# EAGLE design display (EAGLE 9.5.2)

## Sheet 1 of 2
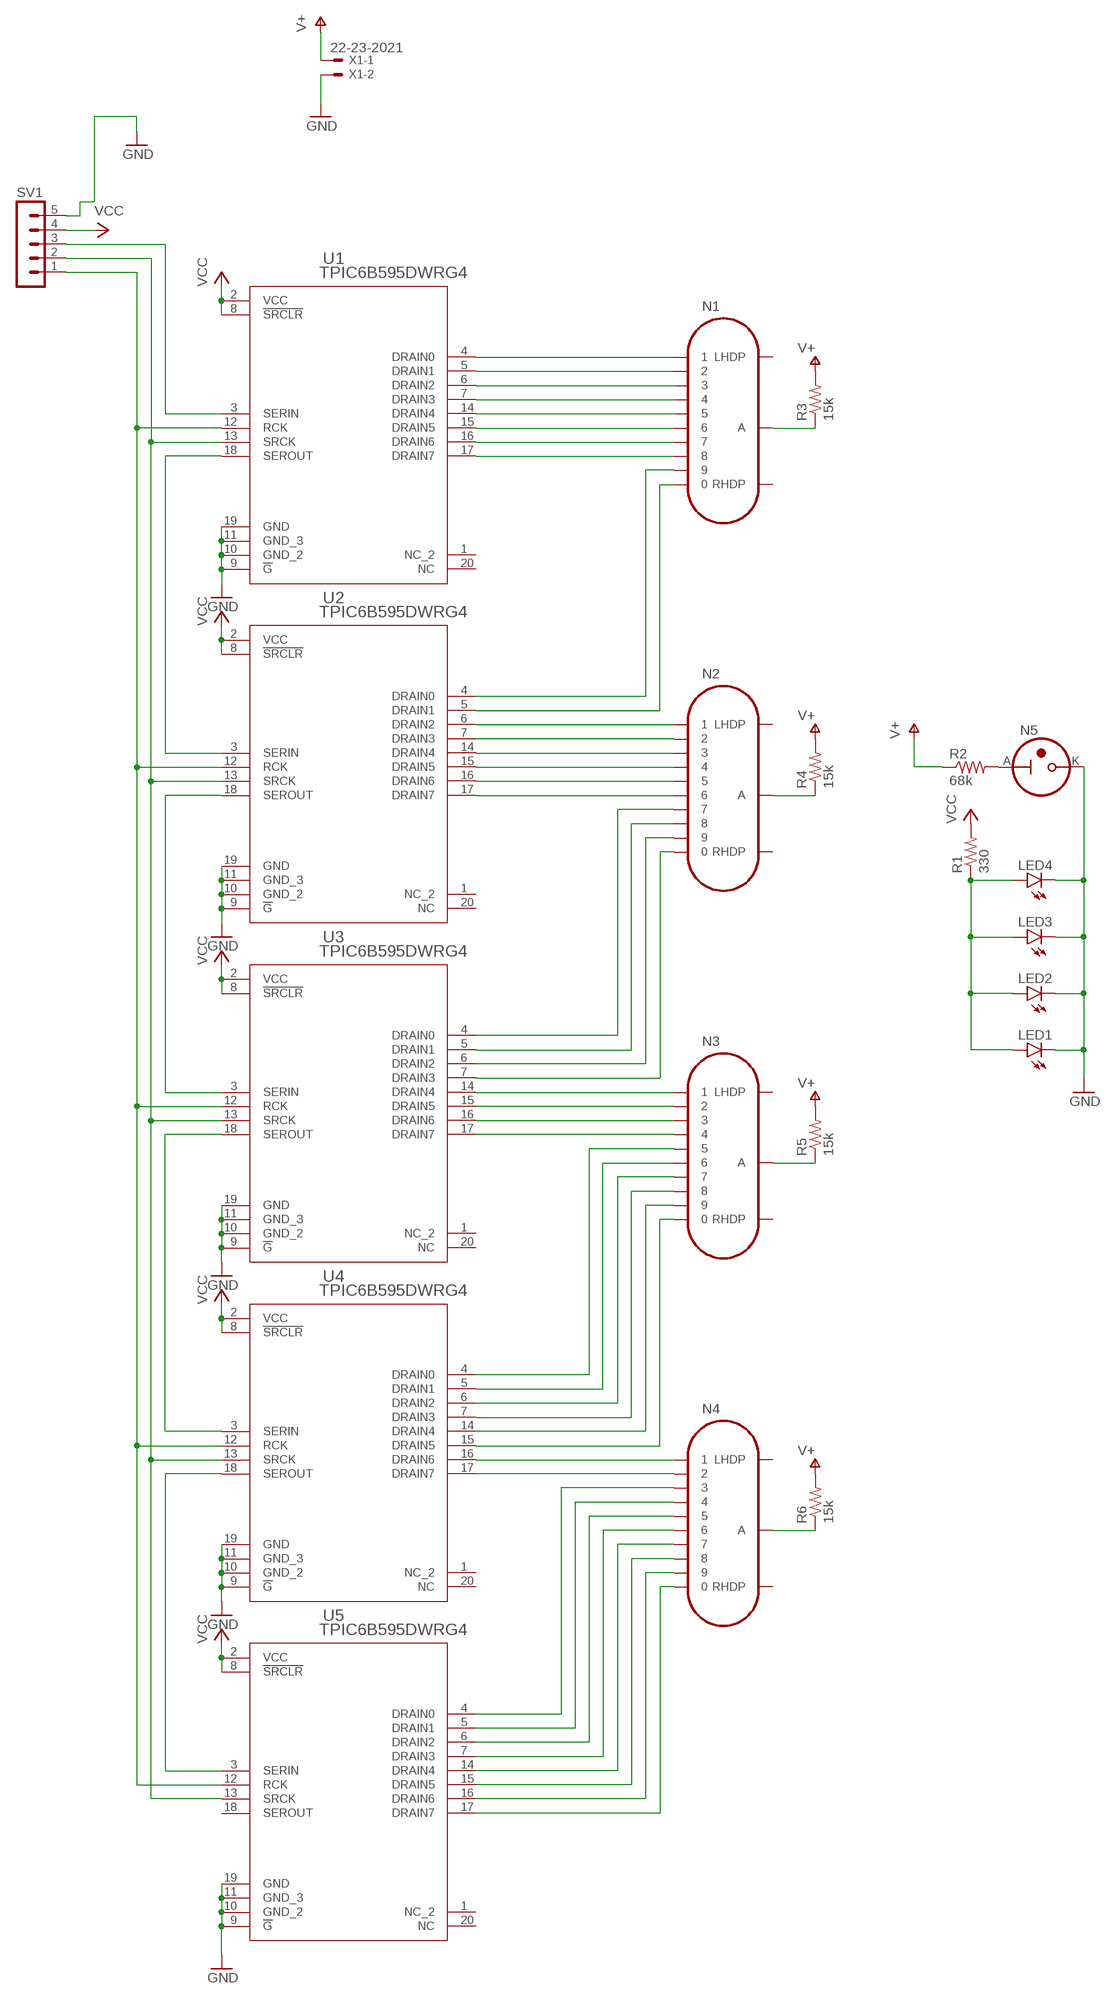
[diagram p0: schematic, sheet 1]

### Parts
LED1  LED3MM  [LED3MM]
LED2  LED3MM  [LED3MM]
LED3  LED3MM  [LED3MM]
LED4  LED3MM  [LED3MM]
N1  IN-14  [IN-14]
N2  IN-14  [IN-14]
N3  IN-14  [IN-14]
N4  IN-14  [IN-14]
N5  IN-3  [IN-3]
R1  330  R-US_R0805  [R0805]
R2  68k  R-US_R0805  [R0805]
R3  15k  R-US_R0805  [R0805]
R4  15k  R-US_R0805  [R0805]
R5  15k  R-US_R0805  [R0805]
R6  15k  R-US_R0805  [R0805]
SV1  MA05-1  [MA05-1]
U1  TPIC6B595DWRG4  [DW20]
U2  TPIC6B595DWRG4  [DW20]
U3  TPIC6B595DWRG4  [DW20]
U4  TPIC6B595DWRG4  [DW20]
U5  TPIC6B595DWRG4  [DW20]
X1  22-23-2021  [22-23-2021]

### Nets
GND: LED1.K(C) LED2.K(C) LED3.K(C) LED4.K(C) N5.K SV1.5 U1.9(!G) U1.10(GND_2) U1.11(GND_3) U1.19(GND) U2.9(!G) U2.10(GND_2) U2.11(GND_3) U2.19(GND) U3.9(!G) U3.10(GND_2) U3.11(GND_3) U3.19(GND) U4.9(!G) U4.10(GND_2) U4.11(GND_3) U4.19(GND) U5.9(!G) U5.10(GND_2) U5.11(GND_3) U5.19(GND) X1.2
N$1: N1.1 U1.4(DRAIN0)
N$2: N1.2 U1.5(DRAIN1)
N$3: N1.3 U1.6(DRAIN2)
N$4: N1.4 U1.7(DRAIN3)
N$5: N1.5 U1.14(DRAIN4)
N$6: N1.6 U1.15(DRAIN5)
N$7: N1.7 U1.16(DRAIN6)
N$8: N1.8 U1.17(DRAIN7)
N$9: N1.9 U2.4(DRAIN0)
N$10: N1.0 U2.5(DRAIN1)
N$11: N2.1 U2.6(DRAIN2)
N$12: N2.2 U2.7(DRAIN3)
N$13: N2.3 U2.14(DRAIN4)
N$14: N2.4 U2.15(DRAIN5)
N$15: N2.5 U2.16(DRAIN6)
N$16: N2.6 U2.17(DRAIN7)
N$17: N2.7 U3.4(DRAIN0)
N$18: N2.8 U3.5(DRAIN1)
N$19: N2.9 U3.6(DRAIN2)
N$20: N2.0 U3.7(DRAIN3)
N$21: LED1.A LED2.A LED3.A LED4.A R1.1
N$22: N5.A R2.2
N$23: N1.A R3.1
N$24: N2.A R4.1
N$25: N3.A R5.1
N$26: N4.A R6.1
N$27: U4.18(SEROUT) U5.3(SERIN)
N$28: SV1.1 U1.12(RCK) U2.12(RCK) U3.12(RCK) U4.12(RCK) U5.12(RCK)
N$29: N3.1 U3.14(DRAIN4)
N$30: N3.2 U3.15(DRAIN5)
N$31: N3.3 U3.16(DRAIN6)
N$32: N3.4 U3.17(DRAIN7)
N$33: N3.8 U4.7(DRAIN3)
N$34: N3.6 U4.5(DRAIN1)
N$35: N3.9 U4.14(DRAIN4)
N$36: N3.5 U4.4(DRAIN0)
N$37: N3.7 U4.6(DRAIN2)
N$38: N3.0 U4.15(DRAIN5)
N$39: N4.1 U4.16(DRAIN6)
N$40: N4.2 U4.17(DRAIN7)
N$41: N4.0 U5.17(DRAIN7)
N$42: N4.9 U5.16(DRAIN6)
N$43: N4.8 U5.15(DRAIN5)
N$44: N4.7 U5.14(DRAIN4)
N$45: N4.6 U5.7(DRAIN3)
N$46: N4.5 U5.6(DRAIN2)
N$47: N4.4 U5.5(DRAIN1)
N$48: N4.3 U5.4(DRAIN0)
N$49: SV1.2 U1.13(SRCK) U2.13(SRCK) U3.13(SRCK) U4.13(SRCK) U5.13(SRCK)
N$52: SV1.3 U1.3(SERIN)
N$77: U1.18(SEROUT) U2.3(SERIN)
N$78: U2.18(SEROUT) U3.3(SERIN)
N$79: U3.18(SEROUT) U4.3(SERIN)
V+: R2.1 R3.2 R4.2 R5.2 R6.2 X1.1
VCC: R1.2 SV1.4 U1.2(VCC) U1.8(!SRCLR) U2.2(VCC) U2.8(!SRCLR) U3.2(VCC) U3.8(!SRCLR) U4.2(VCC) U4.8(!SRCLR) U5.2(VCC) U5.8(!SRCLR)
Unconnected: N1.LHDP N1.RHDP N2.LHDP N2.RHDP N3.LHDP N3.RHDP N4.LHDP N4.RHDP U1.1(NC_2) U1.20(NC) U2.1(NC_2) U2.20(NC) U3.1(NC_2) U3.20(NC) U4.1(NC_2) U4.20(NC) U5.1(NC_2) U5.18(SEROUT) U5.20(NC)

## Sheet 2 of 2

## Library data of the parts
LED1-LED4 = led:LED: LED OSRAM: - CHIPLED LG R971, LG N971, LY N971, LG Q971, LY Q971, LO R971, LY R971 LH N974, LH R974 LS Q976, LO Q976, LY Q976 LO Q996 - Hyper CHIPLED LW Q18S LB Q993, LB Q99A, LB R99A - SideLED LS A670, LO A670, LY A670, LG A670, LP A670 LB A673, LV A673, LT A673, LW A673 LH A674 LY A675 LS A676, LA A676, LO A676, LY A676, LW A676 LS A679, LY A679, LG A679 - Hyper Micro SIDELED® LS Y876, LA Y876, LO Y876, LY Y876 LT Y87S - SmartLED LW L88C, LW L88S LB L89C, LB L89S, LG L890 LS L89K, LO L89K, LY L89K LS L896, LA L896, LO L896, LY L896 - TOPLED LS T670, LO T670, LY T670, LG T670, LP T670 LSG T670, LSP T670, LSY T670, LOP T670, LYG T670 LG T671, LOG T671, LSG T671 LB T673, LV T673, LT T673, LW T673 LH T674 LS T676, LA T676, LO T676, LY T676, LB T676, LH T676, LSB T676, LW T676 LB T67C, LV T67C, LT T67C, LS T67K, LO T67K, LY T67K, LW E67C LS E67B, LA E67B, LO E67B, LY E67B, LB E67C, LV E67C, LT E67C LW T67C LS T679, LY T679, LG T679 LS T770, LO T770, LY T770, LG T770, LP T770 LB T773, LV T773, LT T773, LW T773 LH T774 LS E675, LA E675, LY E675, LS T675 LS T776, LA T776, LO T776, LY T776, LB T776 LHGB T686 LT T68C, LB T68C - Hyper Mini TOPLED® LB M676 - Mini TOPLED Santana® LG M470 LS M47K, LO M47K, LY M47K Source: http://www.osram.convergy.de LUXEON: - LUMILED® LXK2-PW12-R00, LXK2-PW12-S00, LXK2-PW14-U00, LXK2-PW14-V00 LXK2-PM12-R00, LXK2-PM12-S00, LXK2-PM14-U00 LXK2-PE12-Q00, LXK2-PE12-R00, LXK2-PE12-S00, LXK2-PE14-T00, LXK2-PE14-U00 LXK2-PB12-K00, LXK2-PB12-L00, LXK2-PB12-M00, LXK2-PB14-N00, LXK2-PB14-P00, LXK2-PB14-Q00 LXK2-PR12-L00, LXK2-PR12-M00, LXK2-PR14-Q00, LXK2-PR14-R00 LXK2-PD12-Q00, LXK2-PD12-R00, LXK2-PD12-S00 LXK2-PH12-R00, LXK2-PH12-S00 LXK2-PL12-P00, LXK2-PL12-Q00, LXK2-PL12-R00 Source: www.luxeon.com KINGBRIGHT: KA-3528ASYC Source: www.kingbright.com
N1-N4 = nixies-us:IN-14: IN-14: medium numeric frontview nixie tube
N5 = nixies-us:IN-3: IN-3: nixie bulb
R1-R6 = rcl:R-US_: RESISTOR, American symbol; SPICEPREFIX: R
SV1 = con-lstb:MA05-1: PIN HEADER; OC_FARNELL: unknown; OC_NEWARK: unknown
U1-U5 = Digikey:TPIC6B595DWRG4; BUILT_BY: EMA_UL_Team; MANUFACTURER: Texas Instruments; MANUFACTURER_PART_NUMBER: TPIC6B595DWRG4; VENDOR: Texas Instruments
X1 = con-molex:22-23-2021: .100" (2.54mm) Center Header - 2 Pin; MF: MOLEX; MPN: 22-23-2021; OC_FARNELL: 1462926; OC_NEWARK: 25C3832

## Net classes
0 default: width 0.254 mm, clearance 0.381 mm

## Board
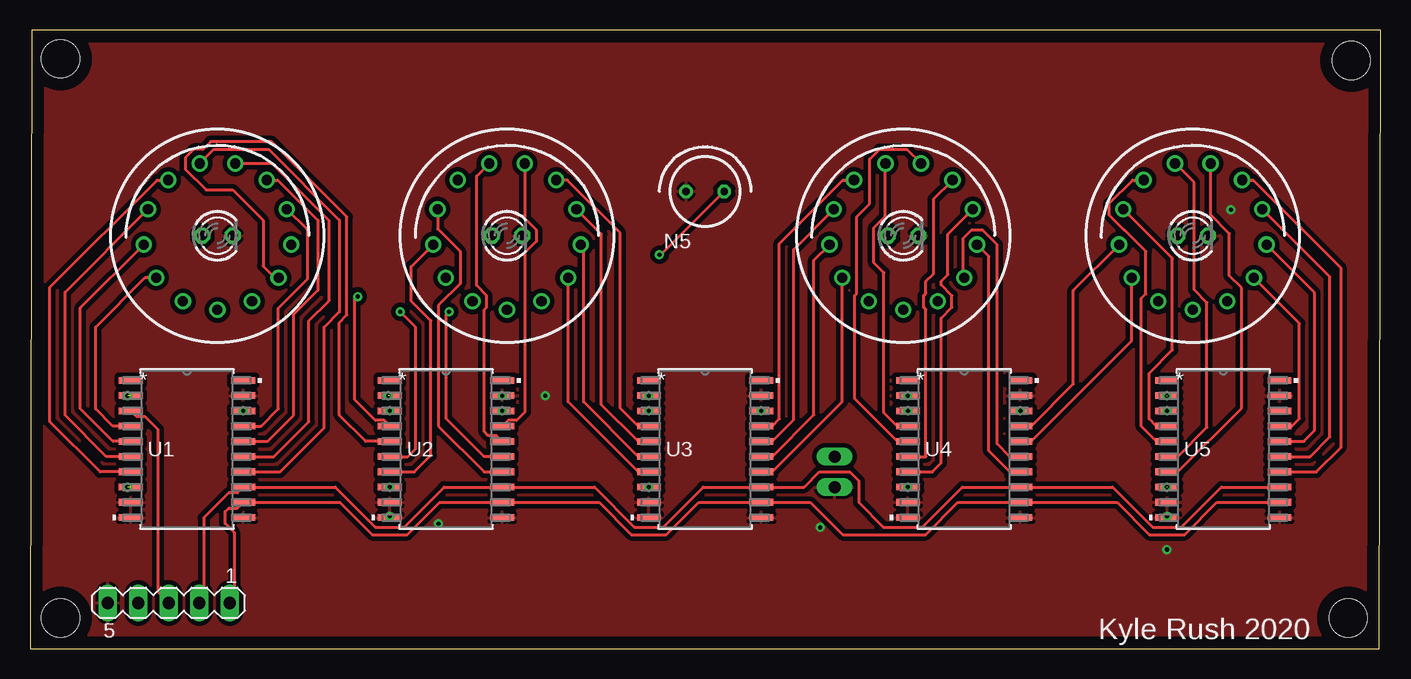
[diagram p1: board, top side]
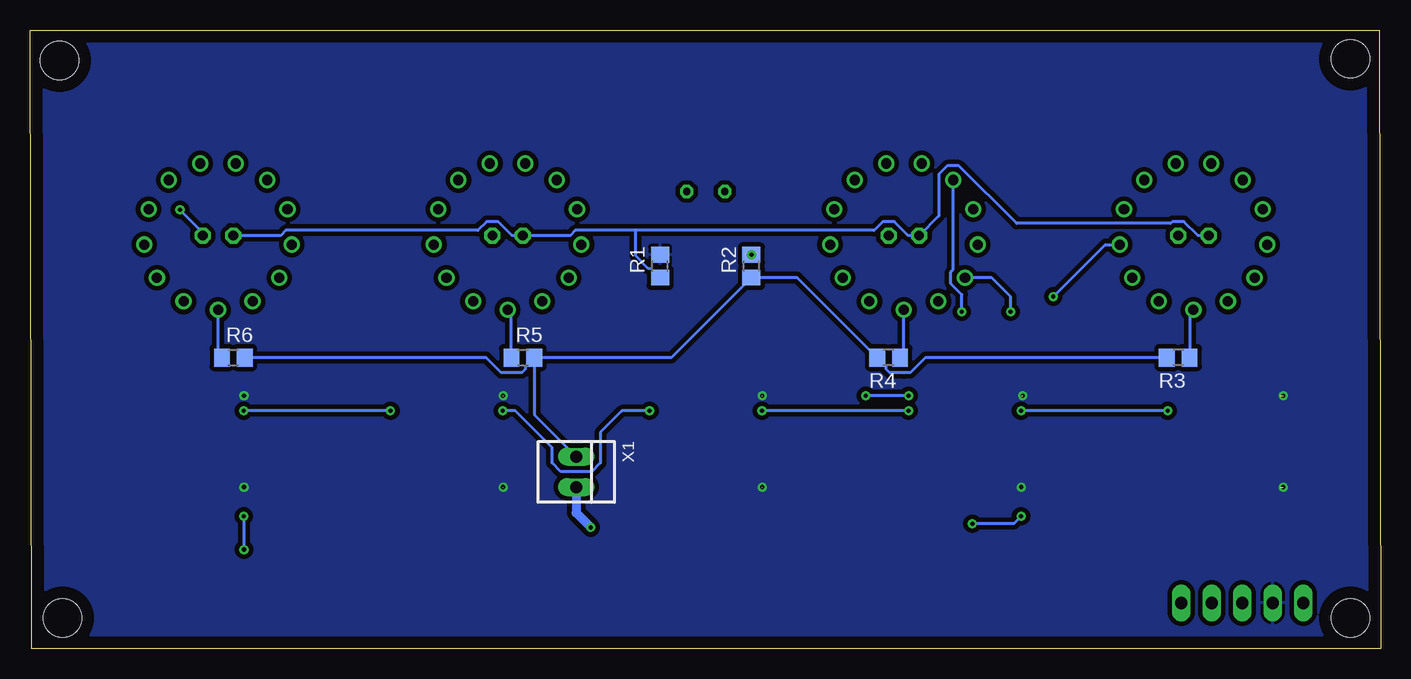
[diagram p2: board, bottom side, seen from below]

Size 112.57 x 51.55 mm. Coordinates in mm from the lower left corner, seen from the top.
Outline: 0,0 112.45,0 112.57,51.55 0.13,51.55 0,0
Copper layers (1*16): Top 0.035mm / dielectric 1.5mm / Bottom 0.035mm
Design rules "default": minimum track width 6mil, minimum drill 0.35mm, track to track 6mil, track to pad 6mil, pad to pad 6mil, via to via 6mil, smd to smd 6mil, copper to edge 40mil, drill to drill 6mil, minimum pad ring 10mil, minimum via ring 8mil, stop-mask expansion 4mil, vias tented up to drill 0mil, thermal gap 10mil
Holes 3.17 mm at 2.54,49.15 2.54,2.54 110.11,49.02 109.86,2.54

### Footprints (pad centres in the part's own frame; a part is rotated, then mirrored left to right if it is on the bottom)
LED3MM = drill 0.813 octagon: A -1.27,0; K 1.27,0
IN-14 = drill 0.84: 0 5.094,-3.516; 1 -5.094,-3.516; 2 -6.145,-0.746; 3 -5.788,2.195; 4 -4.105,4.633; 5 -1.481,6.01; 6 1.481,6.01; 7 4.105,4.633; 8 5.788,2.195; 9 6.145,-0.746; A 0,-6.19; LHDP 2.877,-5.481; RHDP -2.877,-5.481
IN-3 = drill 0.6 octagon: A 1.587,0; K -1.587,0
R0805 = smd 1.3 x 1.5: 1 -0.95,0; 2 0.95,0
MA05-1 = drill 1.016 long: 1 -5.08,0; 2 -2.54,0; 3 0,0; 4 2.54,0; 5 5.08,0
DW20 = smd 1.981 x 0.559: 1 -4.686,5.715; 2 -4.686,4.445; 3 -4.686,3.175; 4 -4.686,1.905; 5 -4.686,0.635; 6 -4.686,-0.635; 7 -4.686,-1.905; 8 -4.686,-3.175; 9 -4.686,-4.445; 10 -4.686,-5.715; 11 4.686,-5.715; 12 4.686,-4.445; 13 4.686,-3.175; 14 4.686,-1.905; 15 4.686,-0.635; 16 4.686,0.635; 17 4.686,1.905; 18 4.686,3.175; 19 4.686,4.445; 20 4.686,5.715
22-23-2021 = drill 1 long: 1 -1.27,0; 2 1.27,0

### Placement (x,y rotation side)
LED1  15.62,34.42 0 top
LED2  39.75,34.42 0 top
LED3  72.77,34.42 0 top
LED4  96.9,34.42 0 top
N1  15.62,34.42 0 top
N2  39.75,34.42 0 top
N3  72.77,34.42 0 top
N4  96.9,34.42 0 top
N5  56.26,38.1 0 top
R1  60.07,31.88 90 bottom
R2  52.45,31.88 90 bottom
R3  16.89,24.26 180 bottom
R4  41.02,24.26 180 bottom
R5  71.5,24.26 0 bottom
R6  95.63,24.26 0 bottom
SV1  11.56,3.81 180 top
U1  13.08,16.64 0 top
U2  34.67,16.64 0 top
U3  56.26,16.64 0 top
U4  77.85,16.64 0 top
U5  99.44,16.64 0 top
X1  67.06,14.73 270 bottom

### Tracks (layer width: path | path; a pad name or v marks a point on that pad's centre or on a via)
GND  (via drill 0.35)
  Top 0.254: U5.10 v94.75,11.02 | U2.10 v29.98,11.02
  Bottom 0.254: LED4.K 98.17,34.67 v100.08,36.58 | U2.19 v42.93,21.08 | v94.75,11.02 94.75,8.27 v94.74,8.26 | v29.98,11.02 30.59,10.41 v34.04,10.41
  Bottom 0.762: X1.2 67.06,11.3 v65.85,10.1
  other vias: 39.36,21.08
  pour Top: 0,51.44 0,0 112.52,0 112.52,51.44
N$1
  Top 0.254: U1.4 6.9,18.54 5.46,19.98 5.46,26.8 9.56,30.9 N1.1
N$2
  Top 0.254: U1.5 6.9,17.27 4.19,19.98 4.19,28.39 N1.2
N$3
  Top 0.254: U1.6 6.37,16 2.92,19.45 2.92,29.7 N1.3
N$4
  Top 0.254: U1.7 5.84,14.73 1.65,18.93 1.65,30.1 10.6,39.05 N1.4
N$5
  Top 0.254: U1.14 20.84,14.73 24.51,18.4 24.51,26.8 25.78,28.07 25.78,35.71 19.88,41.61 15.32,41.61 N1.5
N$6
  Top 0.254: U1.15 20.32,16 23.24,18.93 23.24,27.32 24.88,28.96 24.88,35.71 20.16,40.43 N1.6
N$7
  Top 0.254: U1.16 19.79,17.27 21.97,19.45 21.97,27.85 23.98,29.86 23.98,35.71 20.64,39.05 N1.7
N$8
  Top 0.254: U1.17 19.27,18.54 20.7,19.98 20.7,28.38 23.09,30.76 23.09,34.93 N1.8
N$9  (via drill 0.35)
  Top 0.254: U2.4 29.5,19.02 28.78,19.02 27.05,20.76 27.05,29.34 v27.3,29.34
  Bottom 0.254: v27.3,29.34 22.97,33.67 N1.9
N$10
  Top 0.254: U2.5 27.96,17.27 25.78,19.45 25.78,27.17 26.42,27.8 26.42,35.97 20.14,42.24 15.06,42.24 14.42,41.61 13.65,41.61 12.96,40.92 12.96,39.94 14.67,38.23 16.89,38.23 19.43,35.69 19.43,31.88 20.41,30.9 N1.0
N$11  (via drill 0.35)
  Top 0.254: U2.6 31.5,16 32.13,16.64 32.13,26.8 v30.86,28.07
  Bottom 0.254: v30.86,28.07 30.86,29.34 32.42,30.9 N2.1
N$12
  Top 0.254: N2.2 31.76,31.82 31.76,28.96 33.4,27.32 33.4,16.11 32.02,14.73 U2.7
N$13
  Top 0.254: N2.3 33.96,34.98 35.84,33.11 35.84,30.41 34.04,28.61 34.04,18.54 37.85,14.73 U2.14
N$14  (via drill 0.35)
  Top 0.254: U2.15 37.85,16 34.67,19.18 34.67,27.82 v34.92,28.07
  Bottom 0.254: v34.92,28.07 34.92,29.49 35.84,30.41 35.84,31.39 35.65,31.58 N2.4
N$15
  Top 0.254: U2.16 38.88,17.75 38.16,17.75 37.86,18.05 37.86,28.25 38.06,28.45 38.06,29.43 37.21,30.27 37.21,39.37 N2.5
N$16
  Top 0.254: U2.17 39.84,19.02 40.56,19.02 41.23,19.7 41.23,32.98 42.19,33.93 42.19,34.9 41.23,35.86 N2.6
N$17
  Top 0.254: N2.7 44.77,39.05 49.18,34.64 49.18,20.04 50.68,18.54 U3.4
N$18
  Top 0.254: N2.8 47.61,34.54 47.61,20.34 50.68,17.27 U3.5
N$19
  Top 0.254: N2.9 46.13,33.44 46.13,20.56 50.68,16 U3.6
N$20
  Top 0.254: N2.0 44.84,20.57 50.68,14.73 U3.7
N$21
  Bottom 0.254: LED1.A 15.24,34.42 16.41,35.59 17.38,35.59 17.53,35.43 30.35,35.43 35.16,40.23 36.14,40.23 36.83,39.54 36.83,36.07 LED2.A 39.37,34.42 40.54,35.59 41.51,35.59 42.24,34.85 62.1,34.85 | 62.1,34.85 67.12,34.85 67.55,34.42 LED3.A 72.39,34.42 73.56,35.59 74.53,35.59 75.26,34.85 91.25,34.85 91.68,34.42 LED4.A | R1.1 60.81,31.67 61.03,31.67 62.1,32.74 62.1,34.85
N$22  (via drill 0.35)
  Top 0.254: N5.A 52.58,32.83 R2.2
  other vias: 52.45,32.83
N$23
  Bottom 0.254: N1.A 15.94,27.91 R3.1
N$24
  Bottom 0.254: R4.1 39.75,24.58 N2.A
N$25
  Bottom 0.254: R5.1 72.45,27.91 N3.A
N$26
  Bottom 0.254: R6.1 96.9,24.58 N4.A
N$27  (via drill 0.35)
  Bottom 0.254: U4.18 U5.3
  other vias: 82.54,19.81 94.75,19.81
N$28
  Top 0.254: U5.12 98.91,12.19 96.22,9.5 93.29,9.5 90.6,12.19 U4.12 77.32,12.19 74.63,9.5 67.71,9.5 65.02,12.19 U3.12 55.73,12.19 53.04,9.5 50.11,9.5 47.42,12.19 U2.12 34.14,12.19 31.45,9.5 28.52,9.5 25.83,12.19 U1.12 17.29,11.71 16.57,11.71 16.27,11.41 16.27,10.43 17.02,9.68 17.02,4.19 SV1.1
N$29
  Top 0.254: N3.1 67.68,20.57 61.84,14.73 U3.14
N$30
  Top 0.254: N3.2 65.33,32.37 65.33,19.49 61.84,16 U3.15
N$31
  Top 0.254: N3.3 63.63,33.26 63.63,19.07 61.84,17.27 U3.16
N$32
  Top 0.254: N3.4 67.75,39.05 62.45,33.75 62.45,19.15 61.84,18.54 U3.17
N$33
  Top 0.254: U4.7 75.19,14.73 75.93,15.48 75.93,27.55 76.83,28.45 76.83,29.43 75.93,30.32 75.93,30.61 76.5,31.17 76.5,34.55 N3.8
N$34
  Top 0.254: N3.6 73.07,41.61 70.8,41.61 69.98,40.79 69.98,37.08 68.88,35.98 68.88,29.59 68.71,29.43 68.71,20.83 72.27,17.27 U4.5
N$35
  Top 0.254: N3.9 79.91,32.68 79.91,16.47 81.65,14.73 U4.14
N$36
  Top 0.254: N3.5 71.29,36.04 70.33,35.08 70.33,32.15 71.15,31.33 71.15,19.67 72.27,18.54 U4.4
N$37
  Top 0.254: U4.6 74.66,16 74.66,28.25 74.47,28.45 74.47,29.43 74.66,29.62 74.66,30.61 75.31,31.25 75.31,37.48 N3.7
N$38
  Top 0.254: U4.15 81.65,16 80.59,17.05 80.59,33.66 79.41,34.85 78.43,34.85 77.73,34.16 77.73,31.03 N3.0
N$39
  Top 0.254: N4.1 91.81,25.65 83.43,17.27 U4.16
N$40
  Top 0.254: N4.2 86.94,29.86 86.94,22.05 83.43,18.54 U4.17
N$41
  Top 0.254: U5.17 105.16,18.54 105.79,19.18 105.79,27.11 N4.0
N$42
  Top 0.254: U5.16 106.15,17.27 107.06,18.18 107.06,29.66 N4.9
N$43
  Top 0.254: U5.15 106.68,16 108.33,17.66 108.33,30.97 N4.8
N$44
  Top 0.254: U5.14 107.2,14.73 109.22,16.75 109.22,31.75 101.92,39.05 N4.7
N$45
  Top 0.254: N4.6 98.38,36.17 99.96,34.59 99.96,31.07 100.96,30.07 100.96,20.05 95.65,14.73 U5.7
N$46
  Top 0.254: N4.5 97,38.84 97,29.92 98.08,28.84 98.08,18.44 95.65,16 U5.6
N$47
  Top 0.254: N4.4 91.88,39.05 89.93,37.1 89.93,36.12 91.2,34.85 91.25,34.85 92.99,33.11 92.99,29.57 92.62,29.2 92.62,18.52 93.86,17.27 U5.5
N$48
  Top 0.254: N4.3 95.21,32.52 95.21,24.89 93.26,22.94 93.26,19.15 93.86,18.54 U5.4
N$49
  Top 0.254: U5.13 99.28,13.46 95.96,10.13 93.55,10.13 90.23,13.46 U4.13 77.69,13.46 74.37,10.13 71.12,10.13 69.07,12.18 69.07,13.98 68.33,14.72 65.78,14.72 64.52,13.46 U3.13 56.1,13.46 52.78,10.13 50.37,10.13 47.05,13.46 U2.13 34.51,13.46 31.19,10.13 28.78,10.13 25.46,13.46 U1.13 17.29,12.98 16.57,12.98 14.48,10.89 14.48,4.19 SV1.2
N$52
  Top 0.254: SV1.3 10.67,4.7 10.67,18.26 9.6,19.33 8.88,19.33 U1.3
N$77  (via drill 0.35)
  Bottom 0.254: U1.18 U2.3
  other vias: 17.77,19.81 29.98,19.81
N$78  (via drill 0.35)
  Bottom 0.254: U2.18 U3.3
  other vias: 39.36,19.81 51.57,19.81
N$79  (via drill 0.35)
  Bottom 0.254: U4.3 72.14,19.81 69.07,16.75 69.07,15.48 68.33,14.74 65.78,14.74 65.04,15.48 65.04,18.02 63.25,19.81 U3.18
  other vias: 60.95,19.81 73.16,19.81
V+
  Bottom 0.254: R3.2 37.95,24.26 39.21,23 39.74,23 39.75,22.99 40.92,22.99 41.23,23.3 41.23,23.52 R4.2 48.64,30.93 R2.1 59.12,24.26 R5.2 | R5.2 71.29,23.52 71.29,23.3 71.59,23 73.31,23 74.57,24.26 R6.2 | R5.2 70.55,19.5 X1.1
VCC  (via drill 0.35)  (10 unrouted)
  other vias: 8.13,21.08 29.84,21.08 51.56,21.08 73.15,21.08 94.74,21.08 94.74,13.46 73.15,13.46 51.56,13.46 29.97,13.46 8.13,13.46
  pour Bottom: 0,51.69 0,0 112.27,0 112.27,51.69

### Text on the board
tPlace: Kyle Rush 2020